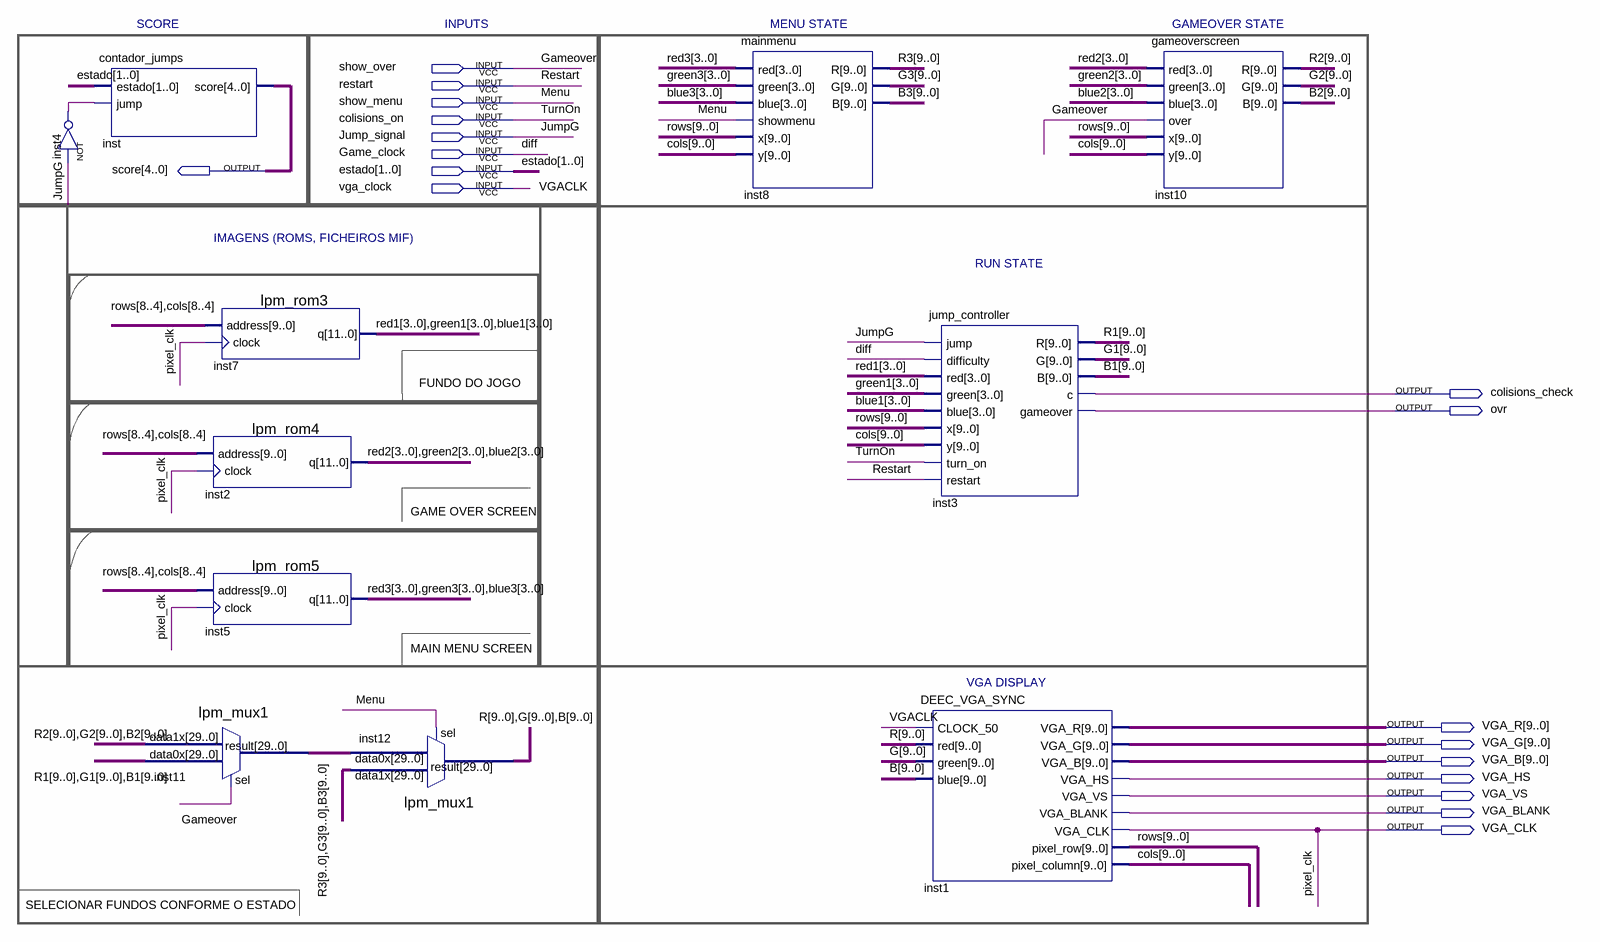
[diagram p0: schematic sheet]
// Quartus schematic datapath.bdf as structural Verilog: 11 symbols, 18 pins
module datapath (
  input  show_over,
  input  restart,
  input  show_menu,
  input  colisions_on,
  input  Jump_signal,
  input  Game_clock,
  input  [1:0] estado,
  input  vga_clock,
  output [4:0] score,
  output colisions_check,
  output ovr,
  output [9:0] VGA_R,
  output [9:0] VGA_G,
  output [9:0] VGA_B,
  output VGA_HS,
  output VGA_VS,
  output VGA_BLANK,
  output VGA_CLK
);

  wire inst4_out;
  wire [3:0] blue1, blue2, blue3, green1, green2, green3, red1, red2, red3;
  wire [9:0] B, B1, B2, B3, cols, G, G1, G2, G3, R, R1, R2, R3, rows;
  wire [29:0] inst11_result;

  not inst4 (inst4_out, Jump_signal);
  contador_jumps inst (.estado(estado), .jump(inst4_out), .score(score));
  lpm_mux1 inst11 (.data1x({R2, G2, B2}), .data0x({R1, G1, B1}), .sel(show_over), .result(inst11_result));
  lpm_rom3 inst7 (.address({rows[8:4], cols[8:4]}), .clock(VGA_CLK), .q({red1, green1, blue1}));
  lpm_rom4 inst2 (.address({rows[8:4], cols[8:4]}), .clock(VGA_CLK), .q({red2, green2, blue2}));
  lpm_rom5 inst5 (.address({rows[8:4], cols[8:4]}), .clock(VGA_CLK), .q({red3, green3, blue3}));
  lpm_mux1 inst12 (.data1x({R3, G3, B3}), .data0x(inst11_result), .sel(show_menu), .result({R, G, B}));
  mainmenu inst8 (
    .red(red3), .green(green3), .blue(blue3), .showmenu(show_menu), .x(rows), .y(cols), .R(R3), .G(G3), .B(B3));
  jump_controller inst3 (
    .jump(Jump_signal), .difficulty(Game_clock), .red(red1), .green(green1), .blue(blue1), .x(rows),
    .y(cols), .turn_on(colisions_on), .restart(restart), .R(R1), .G(G1), .B(B1), .c(colisions_check),
    .gameover(ovr));
  DEEC_VGA_SYNC inst1 (
    .CLOCK_50(vga_clock), .red(R), .green(G), .blue(B), .VGA_R(VGA_R), .VGA_G(VGA_G), .VGA_B(VGA_B),
    .VGA_HS(VGA_HS), .VGA_VS(VGA_VS), .VGA_BLANK(VGA_BLANK), .VGA_CLK(VGA_CLK), .pixel_row(rows),
    .pixel_column(cols));
  gameoverscreen inst10 (
    .red(red2), .green(green2), .blue(blue2), .over(show_over), .x(rows), .y(cols), .R(R2), .G(G2), .B(B2));

  // Other names for the same wires on the sheet: diff = Game_clock; Gameover = show_over; JumpG = Jump_signal;
  //   Menu = show_menu; pixel_clk = VGA_CLK; TurnOn = colisions_on; VGACLK = vga_clock

  // Notes on the sheet:
  //   SCORE
  //   INPUTS
  //   MENU STATE
  //   GAMEOVER STATE
  //   IMAGENS (ROMS, FICHEIROS MIF)
  //   RUN STATE
  //   FUNDO DO JOGO
  //   GAME OVER SCREEN
  //   MAIN MENU SCREEN
  //   VGA DISPLAY
  //   SELECIONAR FUNDOS CONFORME O ESTADO
endmodule
